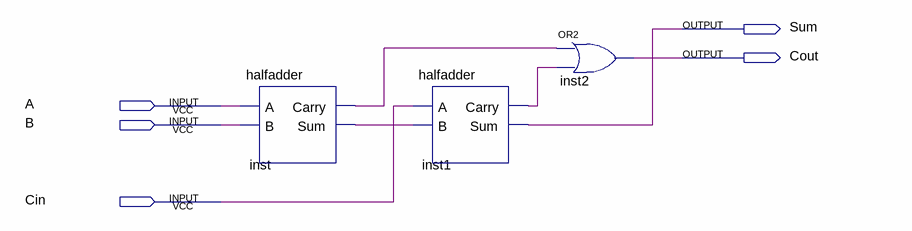
[diagram p0: schematic sheet]
// Quartus schematic fulladder.bdf as structural Verilog: 3 symbols, 5 pins
module fulladder (
  input  A,
  input  B,
  input  Cin,
  output Sum,
  output Cout
);

  wire inst1_carry, inst_carry, inst_sum;

  halfadder inst (.A(A), .B(B), .Carry(inst_carry), .Sum(inst_sum));
  halfadder inst1 (.A(Cin), .B(inst_sum), .Carry(inst1_carry), .Sum(Sum));
  or inst2 (Cout, inst_carry, inst1_carry);
endmodule
